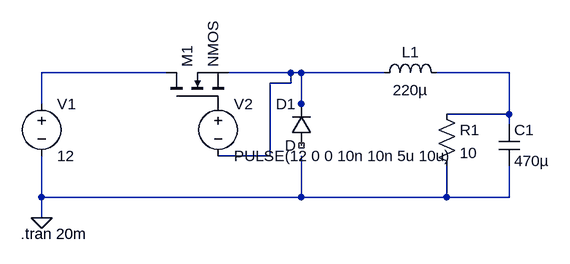
[diagram p0: schematic kullanılan proje.asc]
kullanılan proje.asc, the LTspice schematic file:
Version 4.1
SHEET 1 880 680
WIRE 208 80 16 80
WIRE 400 80 304 80
WIRE 416 80 400 80
WIRE 544 80 416 80
WIRE 736 80 624 80
WIRE 400 96 400 80
WIRE 400 96 368 96
WIRE 16 128 16 80
WIRE 416 128 416 80
WIRE 416 144 416 128
WIRE 736 144 736 80
WIRE 736 144 640 144
WIRE 736 160 736 144
WIRE 368 208 368 96
WIRE 368 208 288 208
WIRE 16 272 16 208
WIRE 416 272 416 208
WIRE 416 272 16 272
WIRE 640 272 640 224
WIRE 640 272 416 272
WIRE 736 272 736 224
WIRE 736 272 640 272
WIRE 16 304 16 272
FLAG 16 304 0
SYMBOL voltage 16 112 R0
WINDOW 123 0 0 Left 0
WINDOW 39 0 0 Left 0
SYMATTR InstName V1
SYMATTR Value 12
SYMBOL ind 528 96 R270
WINDOW 0 32 56 VTop 2
WINDOW 3 5 56 VBottom 2
SYMATTR InstName L1
SYMATTR Value 220µ
SYMATTR SpiceLine Rser=1m
SYMBOL cap 720 160 R0
SYMATTR InstName C1
SYMATTR Value 470µ
SYMBOL voltage 288 112 R0
WINDOW 123 0 0 Left 0
WINDOW 39 0 0 Left 0
SYMATTR InstName V2
SYMATTR Value PULSE(12 0 0 10n 10n 5u 10u)
SYMBOL nmos 208 128 R270
SYMATTR InstName M1
SYMBOL res 624 128 R0
SYMATTR InstName R1
SYMATTR Value 10
SYMBOL diode 432 192 R180
WINDOW 0 24 64 Left 2
WINDOW 3 24 0 Left 2
SYMATTR InstName D1
TEXT -16 328 Left 2 !.tran 20m

The netlist it stands for:
* kullanılan proje.asc
V1 N001 0 12
L1 N002 N003 220µ Rser=1m
C1 N003 0 470µ
V2 P001 N002 PULSE(12 0 0 10n 10n 5u 10u)
M1 N001 P001 N002 N002 NMOS
R1 N003 0 10
D1 NC_01 N002 D
.model D D
.lib standard.dio
.model NMOS NMOS
.model PMOS PMOS
.lib standard.mos
.tran 20m
.backanno
.end